# EAGLE design Power4x4r2_Modified (EAGLE 6.2)
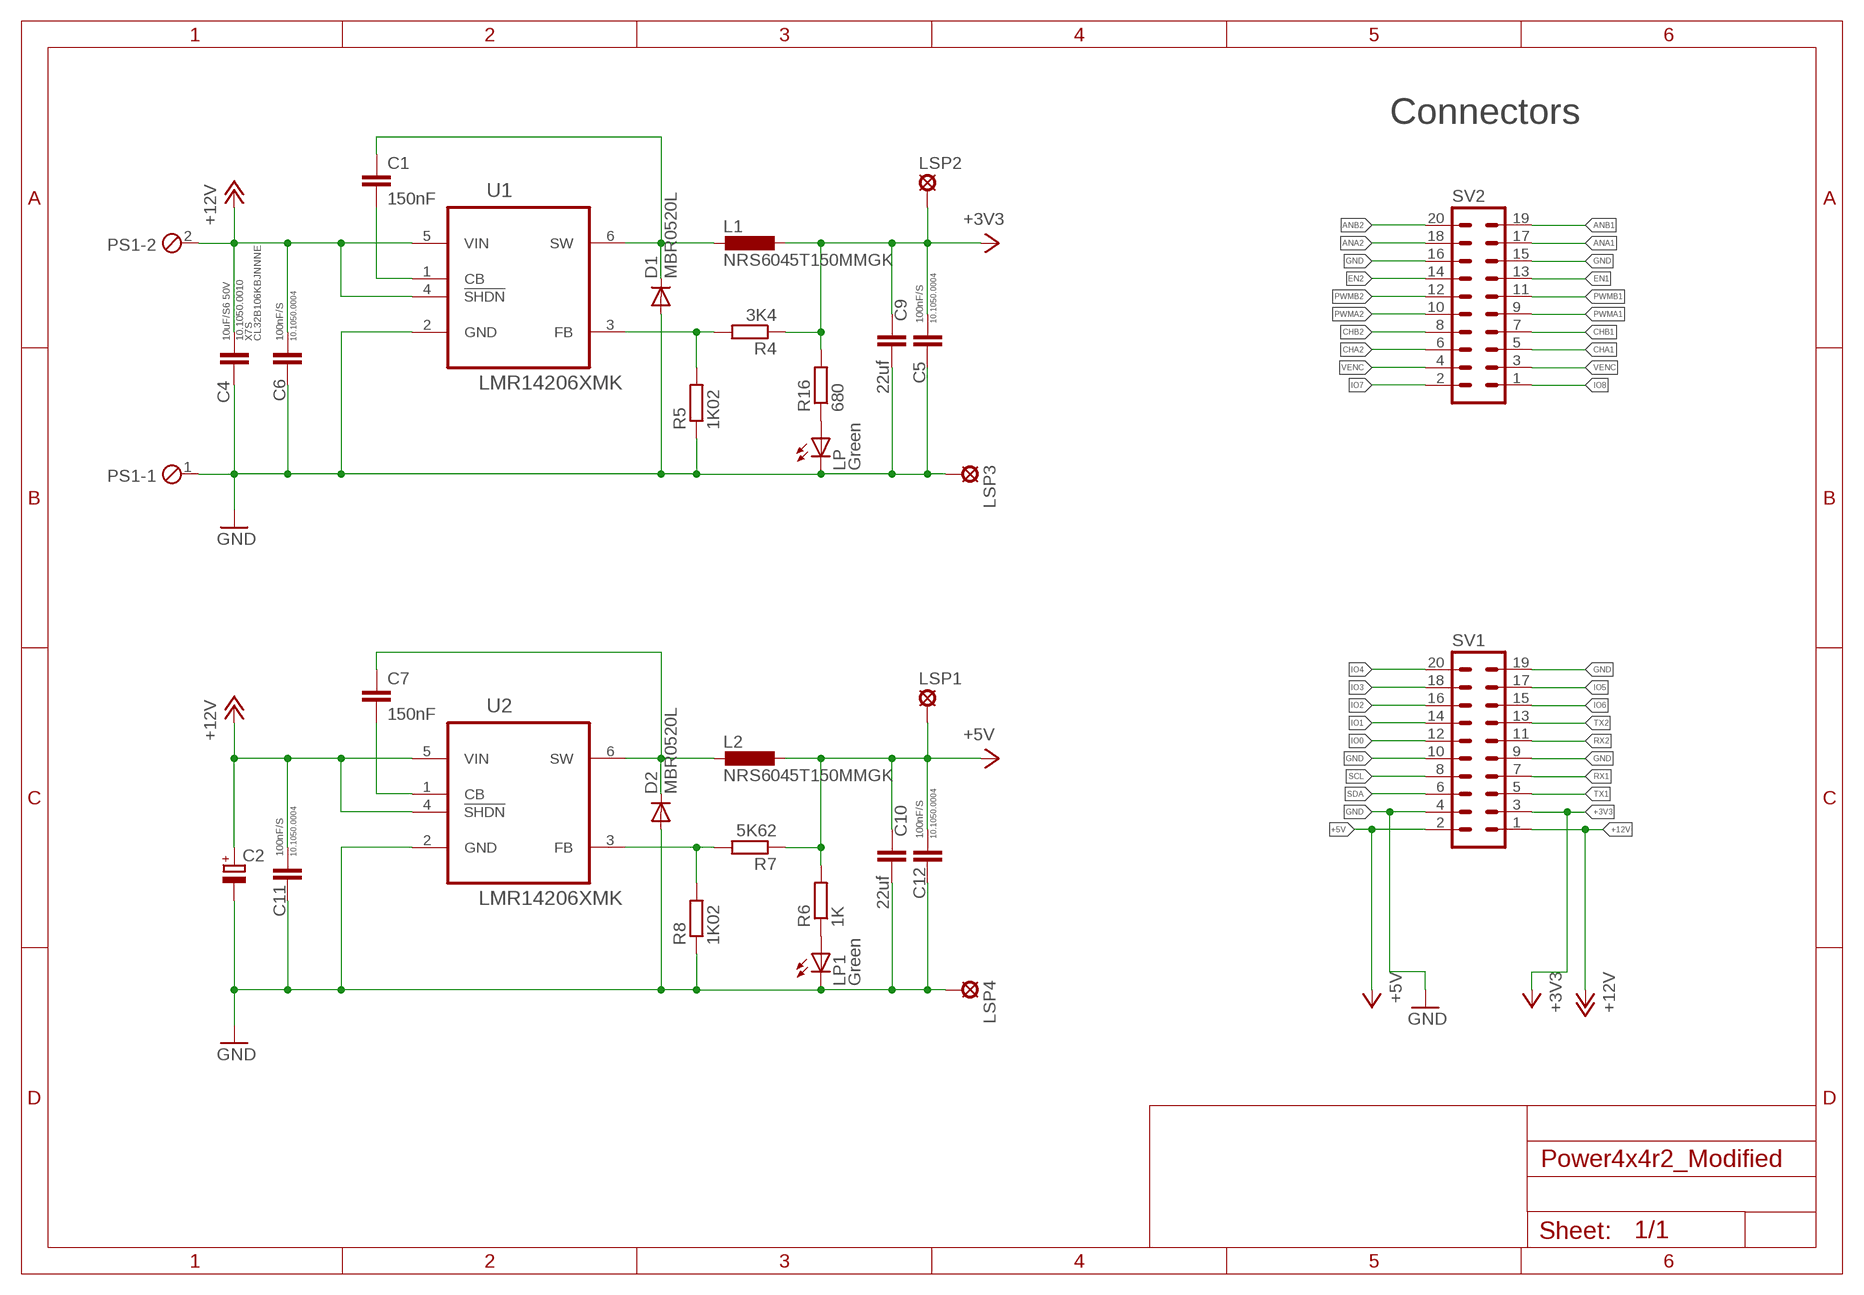
[diagram p0: schematic, sheet 1]

## Parts
C1  150nF  C-EUC0805K  [C0805K]
C2  CPOL-EUUD-6,3X7,7  [UD-6,3X7,7_NICHICON]
C4  10uF/S6 50V  C-EUC3225  [C3225]
C5  100nF/S  C-EUC0805  [C0805]
C6  100nF/S  C-EUC0805  [C0805]
C7  150nF  C-EUC0805K  [C0805K]
C9  22uf  C-EUC1206  [C1206]
C10  22uf  C-EUC1206  [C1206]
C11  100nF/S  C-EUC0805  [C0805]
C12  100nF/S  C-EUC0805  [C0805]
D1  MBR0520L  DIODE-SOD123  [SOD123]
D2  MBR0520L  DIODE-SOD123  [SOD123]
L1  NRS6045T150MMGK  L-EUWE-TPC  [POWER-CHOKE_WE-TPC]
L2  NRS6045T150MMGK  L-EUWE-TPC  [POWER-CHOKE_WE-TPC]
LP  Green  LEDCHIPLED_0805  [CHIPLED_0805]
LP1  Green  LEDCHIPLED_0805  [CHIPLED_0805]
LSP1  LSP10  [LSP10]
LSP2  LSP10  [LSP10]
LSP3  LSP10  [LSP10]
LSP4  LSP10  [LSP10]
PS1  MPT2  [2POL254]
R4  3K4  R-EU_R0805  [R0805]
R5  1K02  R-EU_R0805  [R0805]
R6  1K  R-EU_R0603  [R0603]
R7  5K62  R-EU_R0805  [R0805]
R8  1K02  R-EU_R0805  [R0805]
R16  680  R-EU_R0603  [R0603]
SV1  MA10-2  [MA10-2]
SV2  MA10-2  [MA10-2]
U1  LMR14206XMK  [SOT95P280X110-6N]
U2  LMR14206XMK  [SOT95P280X110-6N]

## Nets
+3V3: C5.2 C9.1 L1.1 LSP2.MP R4.1 R16.2 SV1.3
+5V: C10.1 C12.2 L2.1 LSP1.MP R6.2 R7.1 SV1.2
+12V: C2.+ C4.1 C6.2 C11.2 PS1.2 SV1.1 U1.4(!SHDN) U1.5(VIN) U2.4(!SHDN) U2.5(VIN)
ANA1: SV2.17
ANA2: SV2.18
ANB1: SV2.19
ANB2: SV2.20
CHA1: SV2.5
CHA2: SV2.6
CHB1: SV2.7
CHB2: SV2.8
EN1: SV2.13
EN2: SV2.14
GND: C2.- C4.2 C5.1 C6.1 C9.2 C10.2 C11.1 C12.1 D1.A D2.A LP1.C LP.C LSP3.MP LSP4.MP PS1.1 R5.1 R8.1 SV1.4 SV1.9 SV1.10 SV1.19 SV2.15 SV2.16 U1.2(GND) U2.2(GND)
IO0: SV1.12
IO1: SV1.14
IO2: SV1.16
IO3: SV1.18
IO4: SV1.20
IO5: SV1.17
IO6: SV1.15
IO7: SV2.2
IO8: SV2.1
N$1: C1.2 U1.1(CB)
N$2: C1.1 D1.C L1.2 U1.6(SW)
N$3: LP1.A R6.1
N$4: R4.2 R5.2 U1.3(FB)
N$5: LP.A R16.1
N$6: C7.2 U2.1(CB)
N$7: C7.1 D2.C L2.2 U2.6(SW)
N$8: R7.2 R8.2 U2.3(FB)
PWMA1: SV2.9
PWMA2: SV2.10
PWMB1: SV2.11
PWMB2: SV2.12
RX1: SV1.7
RX2: SV1.11
SCL: SV1.8
SDA: SV1.6
TX1: SV1.5
TX2: SV1.13
VENC: SV2.3 SV2.4

## Notes on the sheet
- Connectors

## Library data of the parts
C1 C7 C9 C10 = rcl:C-EU: CAPACITOR, European symbol
C2 = rcl:CPOL-EU: POLARIZED CAPACITOR, European symbol
C4 = rcl:C-EU: CAPACITOR, European symbol; CASE: C3225 [EIA CC1210]; CODE: CL32B106KBJNNNE; KATODO: 10.1050.0010; TEMPERATURE: X7S
C5 C6 C11 C12 = rcl:C-EU: CAPACITOR, European symbol; KATODO: 10.1050.0004
D1 D2 = diode:DIODE-: DIODE; DIGIKEY: MBR0520LCT-ND
L1 L2 = rcl:L-EU: INDUCTOR, European symbol; DIGIKEY: 587-2948-1-ND
LP LP1 = led:LED: LED OSRAM: - CHIPLED LG R971, LG N971, LY N971, LG Q971, LY Q971, LO R971, LY R971 LH N974, LH R974 LS Q976, LO Q976, LY Q976 LO Q996 - Hyper CHIPLED LW Q18S LB Q993, LB Q99A, LB R99A - SideLED LS A670, LO A670, LY A670, LG A670, LP A670 LB A673, LV A673, LT A673, LW A673 LH A674 LY A675 LS A676, LA A676, LO A676, LY A676, LW A676 LS A679, LY A679, LG A679 - Hyper Micro SIDELED® LS Y876, LA Y876, LO Y876, LY Y876 LT Y87S - SmartLED LW L88C, LW L88S LB L89C, LB L89S, LG L890 LS L89K, LO L89K, LY L89K LS L896, LA L896, LO L896, LY L896 - TOPLED LS T670, LO T670, LY T670, LG T670, LP T670 LSG T670, LSP T670, LSY T670, LOP T670, LYG T670 LG T671, LOG T671, LSG T671 LB T673, LV T673, LT T673, LW T673 LH T674 LS T676, LA T676, LO T676, LY T676, LB T676, LH T676, LSB T676, LW T676 LB T67C, LV T67C, LT T67C, LS T67K, LO T67K, LY T67K, LW E67C LS E67B, LA E67B, LO E67B, LY E67B, LB E67C, LV E67C, LT E67C LW T67C LS T679, LY T679, LG T679 LS T770, LO T770, LY T770, LG T770, LP T770 LB T773, LV T773, LT T773, LW T773 LH T774 LS E675, LA E675, LY E675, LS T675 LS T776, LA T776, LO T776, LY T776, LB T776 LHGB T686 LT T68C, LB T68C - Hyper Mini TOPLED® LB M676 - Mini TOPLED Santana® LG M470 LS M47K, LO M47K, LY M47K Source: http://www.osram.convergy.de LUXEON: - LUMILED® LXK2-PW12-R00, LXK2-PW12-S00, LXK2-PW14-U00, LXK2-PW14-V00 LXK2-PM12-R00, LXK2-PM12-S00, LXK2-PM14-U00 LXK2-PE12-Q00, LXK2-PE12-R00, LXK2-PE12-S00, LXK2-PE14-T00, LXK2-PE14-U00 LXK2-PB12-K00, LXK2-PB12-L00, LXK2-PB12-M00, LXK2-PB14-N00, LXK2-PB14-P00, LXK2-PB14-Q00 LXK2-PR12-L00, LXK2-PR12-M00, LXK2-PR14-Q00, LXK2-PR14-R00 LXK2-PD12-Q00, LXK2-PD12-R00, LXK2-PD12-S00 LXK2-PH12-R00, LXK2-PH12-S00 LXK2-PL12-P00, LXK2-PL12-Q00, LXK2-PL12-R00 Source: www.luxeon.com KINGBRIGHT: KA-3528ASYC Source: www.kingbright.com
LSP1-LSP4 = solpad:LSP10: SOLDER PAD drill 1.0 mm, distributor Buerklin, 12H555
PS1 = Personale:MPT2: PHOENIX CONNECTOR
R4-R8 R16 = rcl:R-EU_: RESISTOR, European symbol
SV1 SV2 = con-lstb:MA10-2: PIN HEADER; OC_FARNELL: unknown; OC_NEWARK: unknown
U1 U2 = LMR14206:LMR14206XMK: IC, SIMPLE SWITCHER 42Vin, 0.6A Step-Down Voltage Regulator in SOT-23-6; DIGIKEY: LMR14206XMKE/NOPBCT-ND; MPN: LMR14206XMK; OC_FARNELL: 2064681; OC_NEWARK: 75T7397; PACKAGE: SOT-23-6; SUPPLIER: TEXAS INSTRUMENTS

## Net classes
1 power: width 0.305 mm, clearance 0.203 mm

## Board
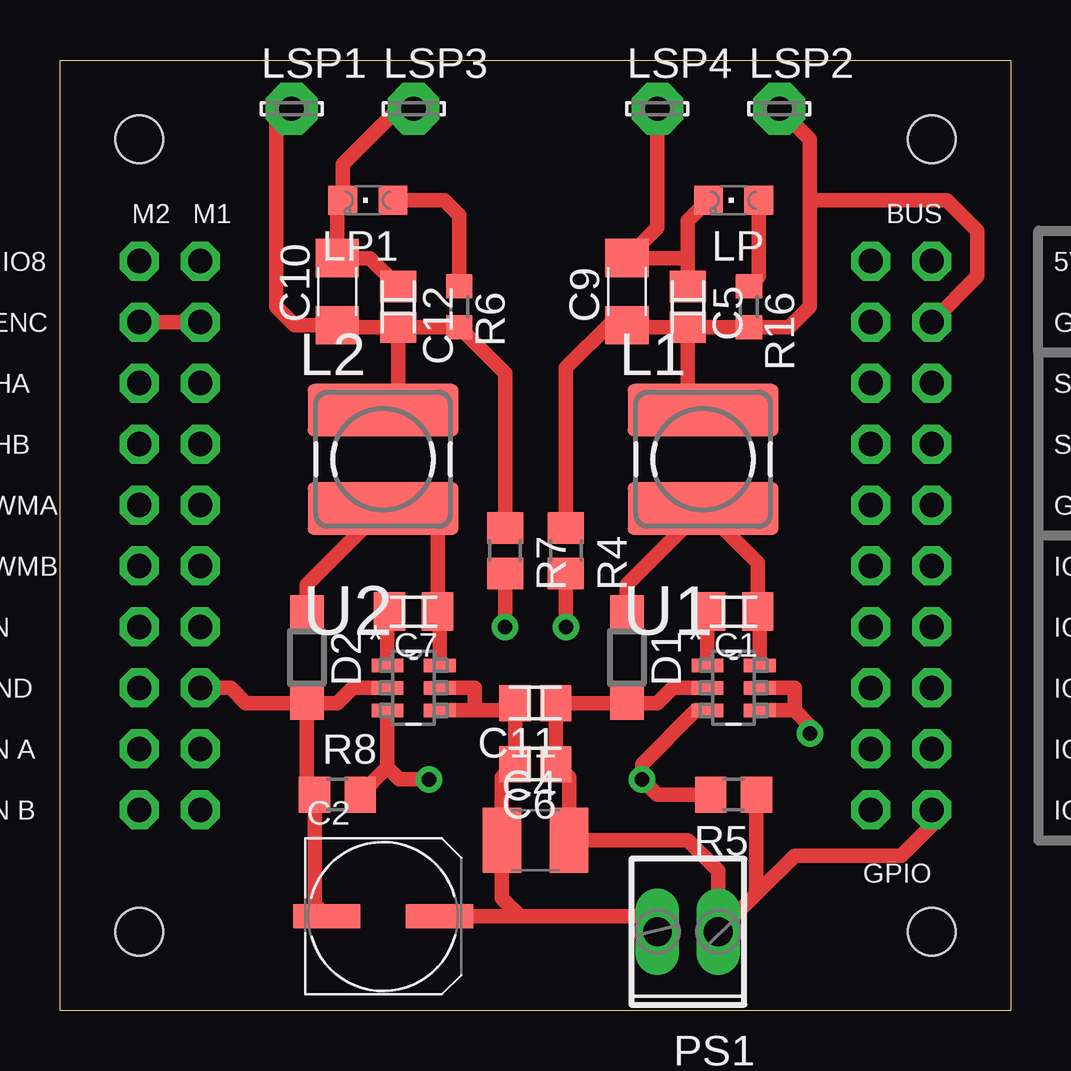
[diagram p1: board, top side]
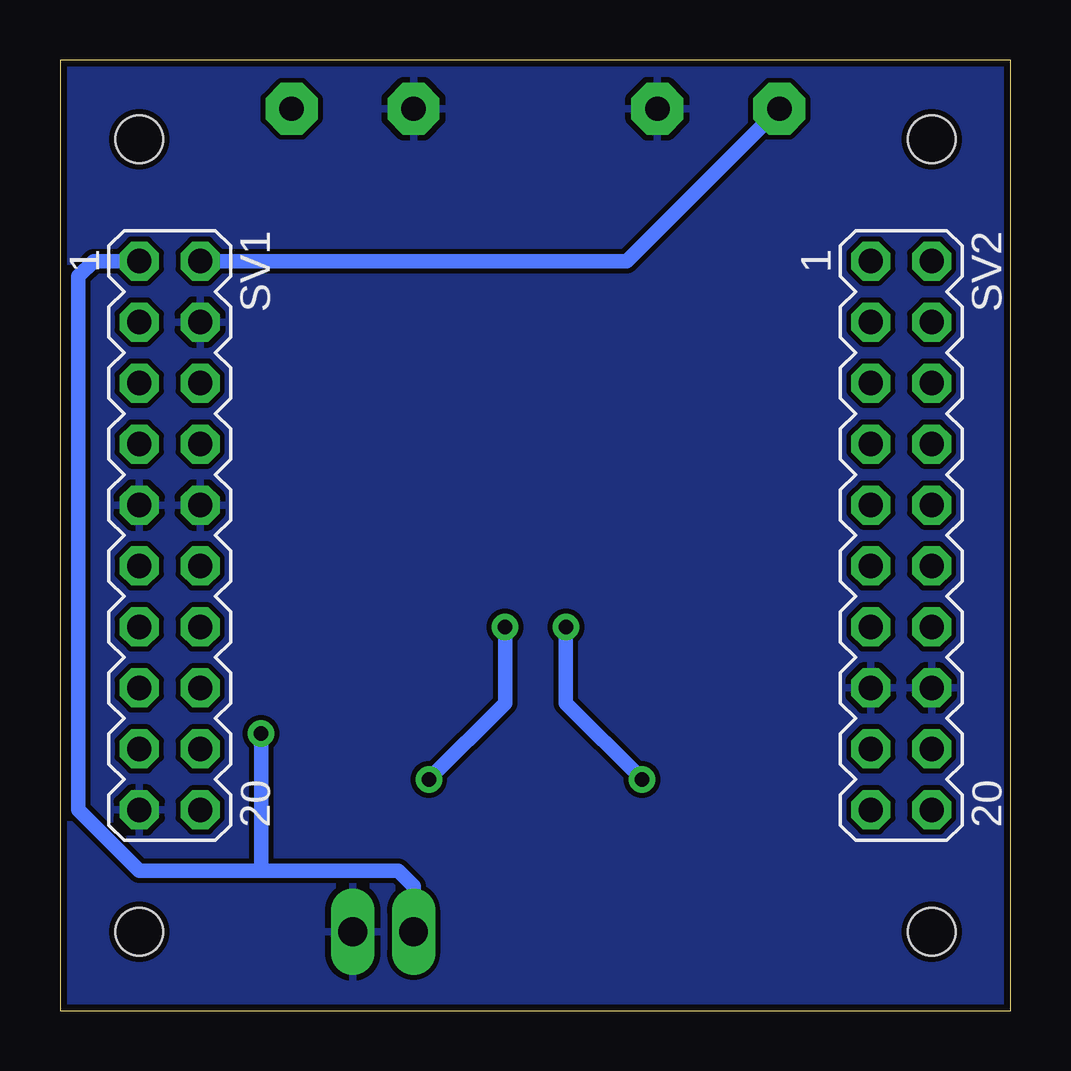
[diagram p2: board, bottom side, seen from below]

Size 39.62 x 39.62 mm. Coordinates in mm from the lower left corner, seen from the top.
Outline: 39.62,39.62 39.62,0 0,0 0,39.62 39.62,39.62
Copper layers (1*16): Top 0.035mm / dielectric 1.5mm / Bottom 0.035mm
Design rules: minimum track width 8mil, minimum drill 20mil, track to track 8mil, track to pad 8mil, pad to pad 8mil, via to via 8mil, smd to smd 8mil, copper to edge 10mil, drill to drill 8mil, minimum pad ring 12mil, minimum via ring 10mil, stop-mask expansion 4mil, vias tented up to drill 25mil, thermal gap 10mil
Holes 2 mm at 3.3,36.32 36.32,3.3 36.32,36.32 3.3,3.3
tRestrict: area -0.8,-2.4 to 42.4,0.1; area -0.8,41.4 to 42.4,43.9; area -2.4,-0.5 to 0.1,42.7; area 41.1,-0.5 to 43.6,42.7
bRestrict: area -2.4,-0.5 to 0.1,42.7; area 41.1,-0.5 to 43.6,42.7; area -0.8,-2.4 to 42.4,0.1; area -0.8,41.4 to 42.4,43.9

### Footprints (pad centres in the part's own frame; a part is rotated, then mirrored left to right if it is on the bottom)
C0805K = smd 1.3 x 1.6: 1 -1,0; 2 1,0
UD-6,3X7,7_NICHICON = smd 2.8 x 1: + 2.35,0; - -2.35,0
C3225 = smd 1.6 x 2.7: 1 -1.4,0; 2 1.4,0
C0805 = smd 1.3 x 1.5: 1 -0.85,0; 2 0.85,0
C1206 = smd 1.6 x 1.8: 1 -1.4,0; 2 1.4,0
SOD123 = smd 1.4 x 1.4: A 1.9,0; C -1.9,0
POWER-CHOKE_WE-TPC = smd 6.3 x 2.2: 1 0,2.05; 2 0,-2.05
CHIPLED_0805 = smd 1.2 x 1.2: A 0,-1.05; C 0,1.05
LSP10 = drill 1.016 pad 2.159 octagon: MP 0,0
2POL254 = drill 1.2 long: 1 -1.27,0; 2 1.27,0
R0805 = smd 1.3 x 1.5: 1 -0.95,0; 2 0.95,0
R0603 = smd 1 x 1.1: 1 -0.85,0; 2 0.85,0
MA10-2 = drill 1.016 octagon: 1 -11.43,-1.27; 2 -11.43,1.27; 3 -8.89,-1.27; 4 -8.89,1.27; 5 -6.35,-1.27; 6 -6.35,1.27; 7 -3.81,-1.27; 8 -3.81,1.27; 9 -1.27,-1.27; 10 -1.27,1.27; 11 1.27,-1.27; 12 1.27,1.27; 13 3.81,-1.27; 14 3.81,1.27; 15 6.35,-1.27; 16 6.35,1.27; 17 8.89,-1.27; 18 8.89,1.27; 19 11.43,-1.27; 20 11.43,1.27
SOT95P280X110-6N = smd 1.321 x 0.559: 1 -1.092,0.94; 2 -1.092,0; 3 -1.092,-0.94; 4 1.092,-0.94; 5 1.092,0; 6 1.092,0.94

### Placement (x,y rotation side)
C1  28.07,16.64 180 top
C2  13.46,3.94 0 top
C4  19.81,7.11 0 top
C5  26.16,29.34 270 top
C6  19.81,10.29 180 top
C7  14.73,16.64 180 top
C9  23.62,29.97 90 top
C10  11.56,29.97 90 top
C11  19.81,12.83 180 top
C12  14.1,29.34 270 top
D1  23.62,14.73 270 top
D2  10.29,14.73 270 top
L1  26.8,22.99 0 top
L2  13.46,22.99 0 top
LP  28.07,33.78 90 top
LP1  12.83,33.78 90 top
LSP1  9.65,37.59 0 top
LSP2  29.97,37.59 0 top
LSP3  14.73,37.59 0 top
LSP4  24.89,37.59 0 top
PS1  26.16,3.3 180 top
R4  21.08,19.18 270 top
R5  28.07,9.02 180 top
R6  16.64,29.34 270 top
R7  18.54,19.18 270 top
R8  11.56,9.02 0 top
R16  28.7,29.34 270 top
SV1  35.05,19.81 270 bottom
SV2  4.57,19.81 270 bottom
U1  28.07,13.46 0 top
U2  14.73,13.46 0 top

### Tracks (layer width: path | path; a pad name or v marks a point on that pad's centre or on a via)
+3V3
  Top 0.61: R4.1 21.08,26.8 22.99,28.7 23.49,28.7 C9.1 23.71,28.49 C5.2 | C5.2 R16.2 30.39,28.49 31.24,29.34 31.24,33.78 | C5.2 26.16,25.67 L1.1 | LSP2.MP 31.24,36.32 31.24,33.78 | SV1.3 38.23,30.61 38.23,32.51 36.96,33.78 31.24,33.78
+5V
  Top 0.61: R7.1 18.54,26.58 R6.2 C12.2 | C12.2 14.1,25.67 L2.1 | C12.2 11.64,28.49 C10.1 9.78,28.57 9.02,29.34 9.02,36.96 LSP1.MP
  Bottom 0.61: SV1.2 16,31.24 LSP1.MP
+12V  (via drill 0.6)
  Top 0.61: U2.4 17.27,12.52 | 17.27,12.52 18.66,12.52 C11.2 C6.2 18.41,9.74 C4.1 18.41,4.7 19.18,3.94 | U2.5 17.27,13.46 17.27,12.52 | 30.61,12.52 U1.4 | C2.+ 19.18,3.94 | 19.18,3.94 24.26,3.94 PS1.2 | 30.61,12.52 31.24,11.89 v31.24,11.56 | U1.5 30.61,13.46 30.61,12.52
  Bottom 0.61: SV1.1 38.23,31.24 38.86,30.61 38.86,8.38 36.32,5.84 31.24,5.84 | 31.24,5.84 25.53,5.84 24.89,5.21 PS1.2 | v31.24,11.56 31.24,5.84
GND
  Top 0.61: U2.2 12.19,13.46 11.56,12.83 D2.A | D2.A 10.29,9.34 R8.1 10.61,4.44 C2.- | U1.2 25.53,13.46 24.89,12.83 D1.A C11.1 C6.1 21.21,9.74 C4.2 26.16,7.11 27.43,5.84 PS1.1 29.02,4.89 | C12.1 12.91,31.37 C10.2 11.56,33.56 LP1.C 11.78,35.27 14.1,37.59 LSP3.MP | C5.1 26.16,31.24 | 26.16,31.24 26.16,32.93 LP.C | 26.16,31.24 26.03,31.37 C9.2 24.89,32.64 LSP4.MP | R5.1 29.02,4.89 | SV1.19 36.32,7.75 35.05,6.48 30.61,6.48 29.02,4.89 | SV2.15 7.11,13.46 7.75,12.83 D2.A
  pour Bottom: -1.78,-1.14 40.13,-1.14 40.13,40.77 -1.14,40.77
N$1
  Top 0.61: U1.1 26.98,16.64 C1.2
N$2
  Top 0.61: U1.6 29.16,16.64 C1.1 29.07,18.67 L1.2 23.62,17.76 D1.C
N$3
  Top 0.61: LP1.A 16,33.78 16.64,33.15 R6.1
N$4  (via drill 0.6)
  Top 0.61: R4.2 v21.08,16 | R5.2 24.89,9.02 v24.26,9.65 24.26,10.29 26.49,12.52 U1.3
  Bottom 0.61: v21.08,16 21.08,12.83 v24.26,9.65
N$5
  Top 0.61: LP.A 29.12,30.6 R16.1
N$6
  Top 0.61: U2.1 13.64,16.55 C7.2
N$7
  Top 0.61: U2.6 15.82,16.55 C7.1 15.73,20.08 14.73,21.08 13.61,21.08 L2.2 10.29,17.76 D2.C
N$8  (via drill 0.6)
  Top 0.61: U2.3 13.64,10.15 | 13.64,10.15 R8.2 | R7.2 v18.54,16 | v15.37,9.65 14.14,9.65 13.64,10.15
  Bottom 0.61: v18.54,16 18.54,12.83 v15.37,9.65
VENC
  Top 0.61: SV2.4 SV2.3

### Text on the board
tPlace: M2 | M1 | BUS | IO7 | IO8 | 5V | 12V | VENC | GND | 3v | CHA | SDA | TX1 | CHB | SCL | RX1 | PWMA | GND | GND | PWMB | IO0 | RX2 | EN | IO1 | TX2 | GND | IO2 | IO6 | AN A | IO3 | IO5 | AN B | IO4 | GND | GPIO